# Altium project smartmouse.PrjPcb
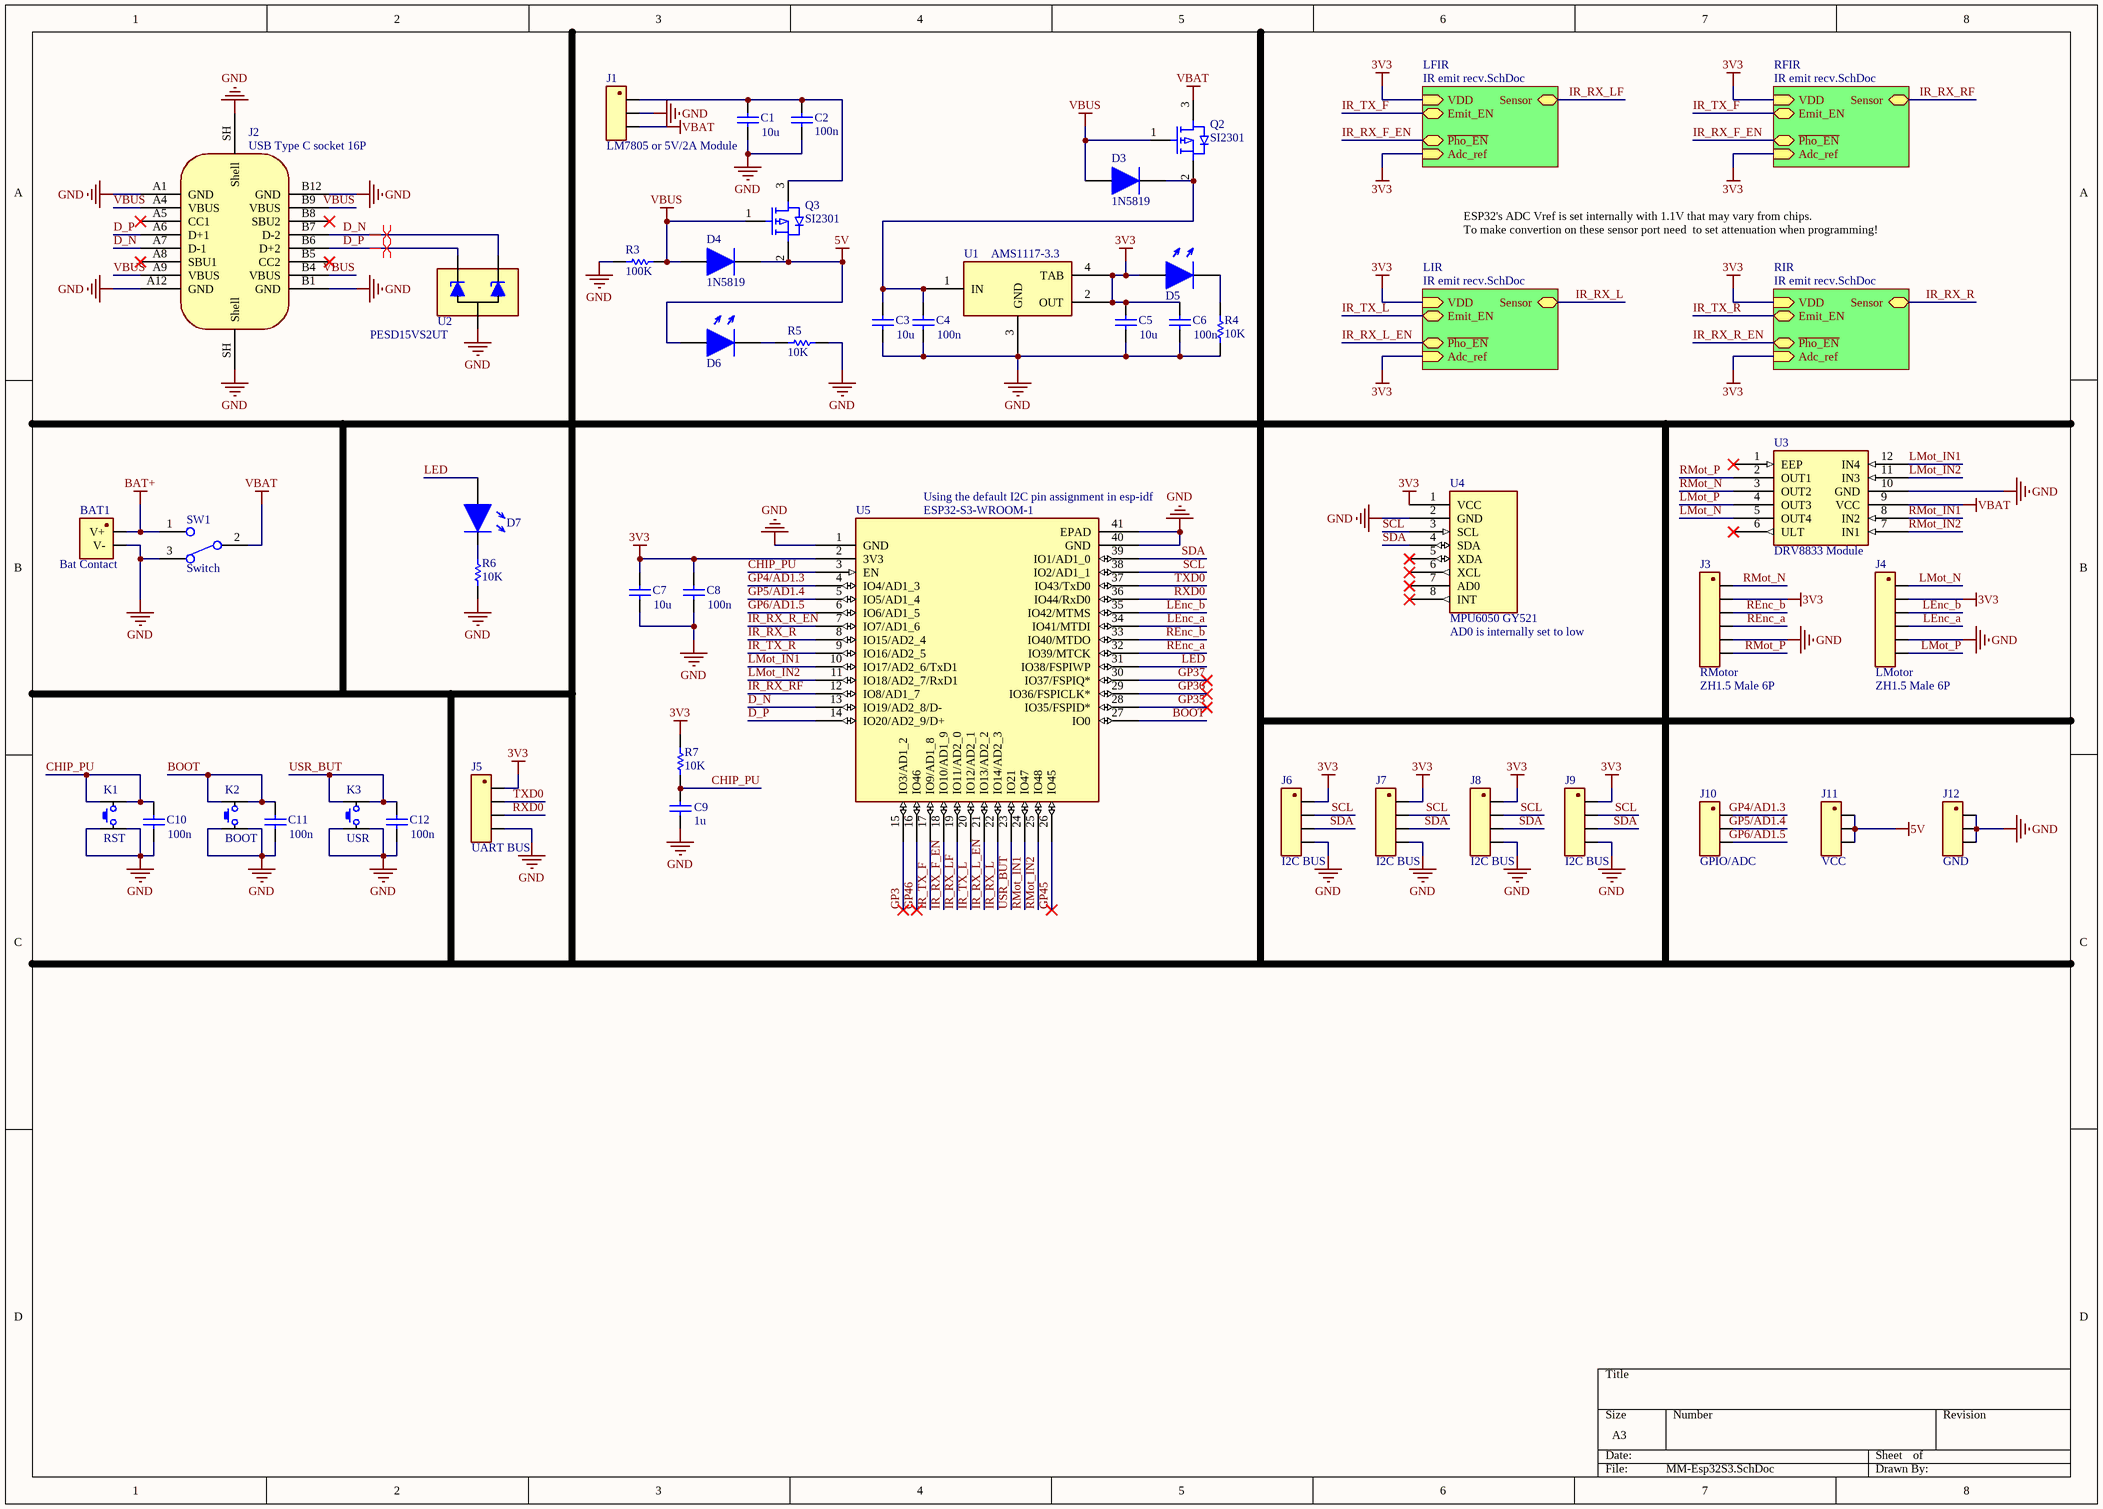
[diagram p0: MM-Esp32S3.SchDoc]
2 sheets, 66 parts. Net scope: hierarchical (ports join the sheet entries above them; power ports are global).
Board file: smartmouse.PcbDoc
Sheets:
  MM-Esp32S3.SchDoc
    LIR = IR emit recv.SchDoc
    RIR = IR emit recv.SchDoc
    LFIR = IR emit recv.SchDoc
    RFIR = IR emit recv.SchDoc

## Sheet MM-Esp32S3.SchDoc
size A3; SheetNumber: 1; SheetTotal: 1

### Parts
BAT1  Bat Contact  [9V BAT SNAP-ON 2 CONTACTS MF]
C1  value 10u  [0805 Cap]  (hidden comment: Cap)
C2  value 100n  [0805 Cap]  (hidden comment: Cap)
C3  value 10u  [0805 Cap]  (hidden comment: Cap)
C4  value 100n  [0805 Cap]  (hidden comment: Cap)
C5  value 10u  [0805 Cap]  (hidden comment: Cap)
C6  value 100n  [0805 Cap]  (hidden comment: Cap)
C7  value 10u  [0805 Cap]  (hidden comment: Cap)
C8  value 100n  [0805 Cap]  (hidden comment: Cap)
C9  value 1u  [0805 Cap]  (hidden comment: Cap)
C10  value 100n  [0805 Cap]  (hidden comment: Cap)
C11  value 100n  [0805 Cap]  (hidden comment: Cap)
C12  value 100n  [0805 Cap]  (hidden comment: Cap)
D3  1N5819  [SOD323 0805]
D4  1N5819  [SOD323 0805]
D5  LED  [LED 3mm]  (value not drawn)
D6  LED  [LED 3mm]  (value not drawn)
D7  LED  [LED 3mm]  (value not drawn)
J1  LM7805 or 5V/2A Module  [Header 3Pins Female DIP]
J2  USB Type C socket 16P  [USB Type C 16P Through hole]
J3  RMotor  Size: ZH1.5 Male 6P  [ZH1.5 6PINS DIP]
J4  LMotor  Size: ZH1.5 Male 6P  [ZH1.5 6PINS DIP]
J5  UART BUS  [Header 4Pins DIP]
J6  I2C BUS  [Header 4Pins DIP]
J7  I2C BUS  [Header 4Pins DIP]
J8  I2C BUS  [Header 4Pins DIP]
J9  I2C BUS  [Header 4Pins DIP]
J10  GPIO/ADC  [Header 3Pins DIP]
J11  VCC  [Header 3Pins DIP]
J12  GND  [Header 3Pins DIP]
K1  RST  [BUTTON TH 6*6*5]
K2  BOOT  [BUTTON TH 6*6*5]
K3  USR  [BUTTON TH 6*6*5]
Q2  SI2301  [SOT23-3]
Q3  SI2301  [SOT23-3]
R3  value 100K  [0805 R/L]  (hidden comment: Res)
R4  value 10K  [0805 R/L]  (hidden comment: Res)
R5  value 10K  [0805 R/L]  (hidden comment: Res)
R6  value 10K  [0805 R/L]  (hidden comment: Res)
R7  value 10K  [0805 R/L]  (hidden comment: Res)
SW1  Switch  [Slide switch]
U1  AMS1117-3.3  [SOT-223]
U2  PESD15VS2UT  [SOT23-3]
U3  DRV8833 Module  [DRV8833 MODULE]
U4  MPU6050 GY521  [MPU6050 Module]
U5  ESP32-S3-WROOM-1  [ESP32-WROOM]

### Sub-sheets
LFIR = IR emit recv.SchDoc: Sensor (bidir), VDD (in), ~{Pho_EN} (bidir), Emit_EN (bidir), Adc_ref (in)
LIR = IR emit recv.SchDoc: Sensor (bidir), VDD (in), ~{Pho_EN} (bidir), Emit_EN (bidir), Adc_ref (in)
RFIR = IR emit recv.SchDoc: Sensor (bidir), VDD (in), ~{Pho_EN} (bidir), Emit_EN (bidir), Adc_ref (in)
RIR = IR emit recv.SchDoc: Sensor (bidir), VDD (in), ~{Pho_EN} (bidir), Emit_EN (bidir), Adc_ref (in)

### Nets
3V3: C5.2 C6.2 C7.2 C8.2 D5.2 J3.2 J4.2 J5.1 J6.1 J7.1 J8.1 J9.1 R7.1 U1.2(OUT) U1.4(TAB) U4.1(VCC) U5.2(3V3) ; sheet LIR/VDD, sheet LIR/Adc_ref, sheet RIR/VDD, sheet RIR/Adc_ref, sheet LFIR/VDD, sheet LFIR/Adc_ref, sheet RFIR/VDD, sheet RFIR/Adc_ref
5V: D4.2 D6.2 J11.1 J11.2 J11.3 Q3.2(S)
BAT+: BAT1.1(V+) SW1.1
GND: BAT1.2(V-) C1.1 C2.1 C3.1 C4.1 C5.1 C6.1 C7.1 C8.1 C9.1 C10.1 C11.1 C12.1 J1.2 J2.A1(GND) J2.A12(GND) J2.B1(GND) J2.B12(GND) J2.SH(Shell) J3.5 J4.5 J5.4 J6.4 J7.4 J8.4 J9.4 J12.1 J12.2 J12.3 K1.3 K1.4 K2.3 K2.4 K3.3 K3.4 R3.2 R4.2 R5.2 R6.2 SW1.3 U1.3(GND) U2.3 U3.10(GND) U4.2(GND) U5.1(GND) U5.40(GND) U5.41(EPAD)
VBAT: J1.3 Q2.3(D) SW1.2 U3.9(VCC)
VBUS: D3.1 D4.1 J2.A4(VBUS) J2.A9(VBUS) J2.B4(VBUS) J2.B9(VBUS) Q2.1(G) Q3.1(G) R3.1
BOOT: C11.2 K2.1 K2.2 U5.27(IO0)
CHIP_PU: C9.2 C10.2 K1.1 K1.2 R7.2 U5.3(EN)
D_N: J2.A7(D-1) J2.B7(D-2) U2.1 U5.13(IO19/AD2_8/D-)
D_P: J2.A6(D+1) J2.B6(D+2) U2.2 U5.14(IO20/AD2_9/D+)
GP3: U5.15(IO3/AD1_2)
GP4/AD1.3: J10.1 U5.4(IO4/AD1_3)
GP5/AD1.4: J10.2 U5.5(IO5/AD1_4)
GP6/AD1.5: J10.3 U5.6(IO6/AD1_5)
GP35: U5.28(IO35/FSPID*)
GP36: U5.29(IO36/FSPICLK*)
GP37: U5.30(IO37/FSPIQ*)
GP45: U5.26(IO45)
GP46: U5.16(IO46)
IR_RX_F_EN: U5.18(IO10/AD1_9) ; sheet LFIR/~{Pho_EN}, sheet RFIR/~{Pho_EN}
IR_RX_L: U5.22(IO14/AD2_3) ; sheet LIR/Sensor
IR_RX_L_EN: U5.21(IO13/AD2_2) ; sheet LIR/~{Pho_EN}
IR_RX_LF: U5.19(IO11/AD2_0) ; sheet LFIR/Sensor
IR_RX_R: U5.8(IO15/AD2_4) ; sheet RIR/Sensor
IR_RX_R_EN: U5.7(IO7/AD1_6) ; sheet RIR/~{Pho_EN}
IR_RX_RF: U5.12(IO8/AD1_7) ; sheet RFIR/Sensor
IR_TX_F: U5.17(IO9/AD1_8) ; sheet LFIR/Emit_EN, sheet RFIR/Emit_EN
IR_TX_L: U5.20(IO12/AD2_1) ; sheet LIR/Emit_EN
IR_TX_R: U5.9(IO16/AD2_5) ; sheet RIR/Emit_EN
LED: D7.2 U5.31(IO38/FSPIWP)
LEnc_a: J4.4 U5.34(IO41/MTDI)
LEnc_b: J4.3 U5.35(IO42/MTMS)
LMot_IN1: U3.12(IN4) U5.10(IO17/AD2_6/TxD1)
LMot_IN2: U3.11(IN3) U5.11(IO18/AD2_7/RxD1)
LMot_N: J4.1 U3.5(OUT4)
LMot_P: J4.6 U3.4(OUT3)
REnc_a: J3.4 U5.32(IO39/MTCK)
REnc_b: J3.3 U5.33(IO40/MTDO)
RMot_IN1: U3.8(IN2) U5.24(IO47)
RMot_IN2: U3.7(IN1) U5.25(IO48)
RMot_N: J3.1 U3.3(OUT2)
RMot_P: J3.6 U3.2(OUT1)
RXD0: J5.3 U5.36(IO44/RxD0)
SCL: J6.2 J7.2 J8.2 J9.2 U4.3(SCL) U5.38(IO2/AD1_1)
SDA: J6.3 J7.3 J8.3 J9.3 U4.4(SDA) U5.39(IO1/AD1_0)
TXD0: J5.2 U5.37(IO43/TxD0)
USR_BUT: C12.2 K3.1 K3.2 U5.23(IO21)
NetC1_2: C1.2 C2.2 J1.1 Q3.3(D)
NetC3_2: C3.2 C4.2 D3.2 Q2.2(S) U1.1(IN)
NetD5_1: D5.1 R4.1
NetD6_1: D6.1 R5.1
NetD7_1: D7.1 R6.1

Not connected (* = marked no-connect by the designer): J2 A5(CC1)* A8(SBU1)* B5(CC2)* B8(SBU2)*; U3 1(EEP)* 6(ULT)*; U4 5(XDA)* 6(XCL)* 7(AD0)* 8(INT)*

### Layout directives
differential pair: D_N, D_P

### Notes on the sheet
- ESP32's ADC Vref is set internally with 1.1V that may vary from chips.
  To make convertion on these sensor port need  to set attenuation when programming!
- (near U5) Using the default I2C pin assignment in esp-idf
- (near U4) AD0 is internally set to low

### Library data of the parts
C1-C12 = Cap: 无极电容
D3 D4 = Diode
D5-D7 = LED: 发光二极管
J1 J10-J12 = Header 3pin
J2 = USB Type C socket 16P: USB Type C母座 16P
J3 J4 = Header 6pin
J5-J9 = Header 4pin
K1-K3 = Button: 按键开关
Q2 Q3 = PMOS
SW1 = Switch: 开关 拨动开关 滑动开关
U1 = AMS1117
U2 = PESD15VS2UT: 静电放电(ESD)保护器件
U3 = DRV8833 Module: DRV8833两路电机驱动模块 / https://detail.tmall.com/item.htm?id=543193414673
U4 = MPU6050 GY521: 淘宝上最常用的8针脚MPU6050
U5 = ESP32-S3-WROOM-1: 乐鑫ESP32S3Wroom模组 / 内置芯片为ESP32-S3R8的模组中,*管脚只能用于连至内部的OSPI PSRAM

## Sheet IR emit recv.SchDoc
size A4
Used 4 times, as channels LIR, RIR, LFIR, RFIR. Parts and nets are listed once, with the designators drawn on the sheet.
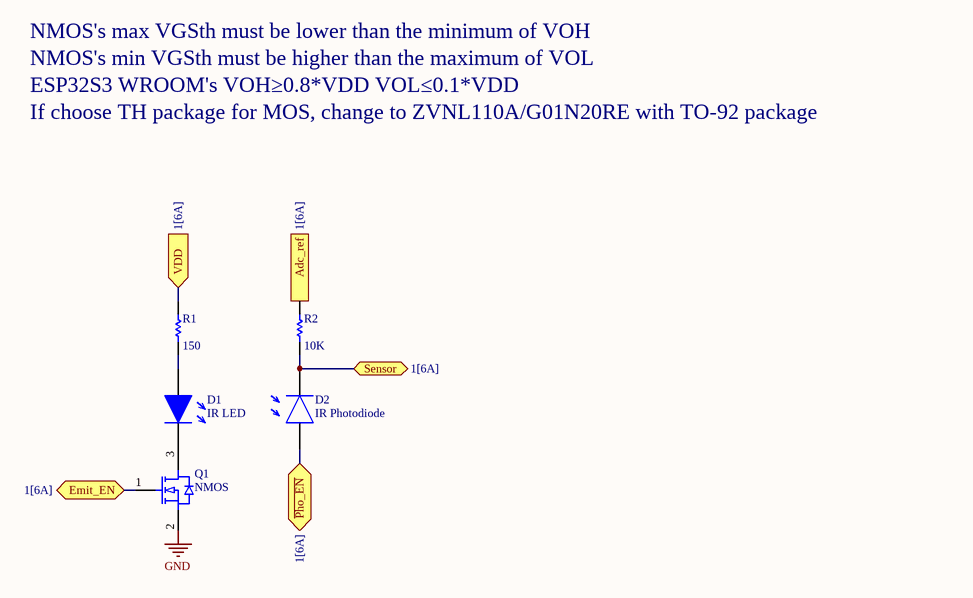
[diagram p1: IR emit recv.SchDoc]

### Parts
D1  IR LED  [LED 3mm LH THT Clear]
D2  IR Photodiode  [LED 3mm RH THT IRBlack]
Q1  NMOS  [SOT23-3]
R1  value 150  [0805 R/L]  (hidden comment: Res)
R2  value 10K  [0805 R/L]  (hidden comment: Res)

### Ports
Adc_ref (in, see 1[6A]), Emit_EN (bidir, see 1[6A]), Sensor (bidir, see 1[6A]), VDD (in, see 1[6A]), ~{Pho_EN} (bidir, see 1[6A])

### Nets
GND: Q1.2(S)
Adc_ref: R2.2 ; port Adc_ref
Emit_EN: Q1.1(G) ; port Emit_EN
~{Pho_EN}: D2.2 ; port ~{Pho_EN}
Sensor: D2.1 R2.1 ; port Sensor
VDD: R1.2 ; port VDD
NetD1_1: D1.1 Q1.3(D)
NetD1_2: D1.2 R1.1

### Channels
LIR: designators end in _LIR; ports Adc_ref=3V3 Emit_EN=IR_TX_L Sensor=IR_RX_L VDD=3V3 ~{Pho_EN}=IR_RX_L_EN
RIR: designators end in _RIR; ports Adc_ref=3V3 Emit_EN=IR_TX_R Sensor=IR_RX_R VDD=3V3 ~{Pho_EN}=IR_RX_R_EN
LFIR: designators end in _LFIR; ports Adc_ref=3V3 Emit_EN=IR_TX_F Sensor=IR_RX_LF VDD=3V3 ~{Pho_EN}=IR_RX_F_EN
RFIR: designators end in _RFIR; ports Adc_ref=3V3 Emit_EN=IR_TX_F Sensor=IR_RX_RF VDD=3V3 ~{Pho_EN}=IR_RX_F_EN

### Notes on the sheet
- NMOS's max VGSth must be lower than the minimum of VOH
- NMOS's min VGSth must be higher than the maximum of VOL
- ESP32S3 WROOM's VOH≥0.8*VDD VOL≤0.1*VDD
- If choose TH package for MOS, change to ZVNL110A/G01N20RE with TO-92 package

### Library data of the parts
D1 = LED: 发光二极管

## Nets that join several sheets
3V3: MM-Esp32S3 (17 pins), LIR (R1_LIR.2 R2_LIR.2), RIR (R1_RIR.2 R2_RIR.2), LFIR (R1_LFIR.2 R2_LFIR.2), RFIR (R1_RFIR.2 R2_RFIR.2)
GND: MM-Esp32S3 (47 pins), LIR (Q1_LIR.2), RIR (Q1_RIR.2), LFIR (Q1_LFIR.2), RFIR (Q1_RFIR.2)
IR_RX_F_EN: MM-Esp32S3 (U5.18), LFIR (D2_LFIR.2), RFIR (D2_RFIR.2)
IR_RX_L: MM-Esp32S3 (U5.22), LIR (D2_LIR.1 R2_LIR.1)
IR_RX_L_EN: MM-Esp32S3 (U5.21), LIR (D2_LIR.2)
IR_RX_LF: MM-Esp32S3 (U5.19), LFIR (D2_LFIR.1 R2_LFIR.1)
IR_RX_R: MM-Esp32S3 (U5.8), RIR (D2_RIR.1 R2_RIR.1)
IR_RX_R_EN: MM-Esp32S3 (U5.7), RIR (D2_RIR.2)
IR_RX_RF: MM-Esp32S3 (U5.12), RFIR (D2_RFIR.1 R2_RFIR.1)
IR_TX_F: MM-Esp32S3 (U5.17), LFIR (Q1_LFIR.1), RFIR (Q1_RFIR.1)
IR_TX_L: MM-Esp32S3 (U5.20), LIR (Q1_LIR.1)
IR_TX_R: MM-Esp32S3 (U5.9), RIR (Q1_RIR.1)